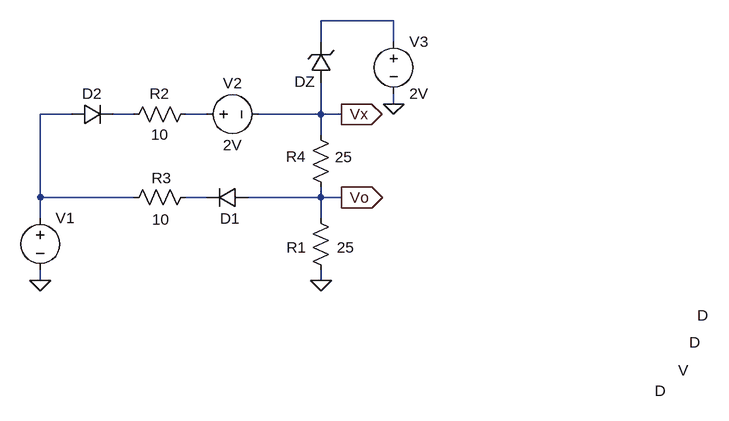
[diagram p0: schematic circuito1.asc]
circuito1.asc, the LTspice schematic file:
Version 4
SHEET 1 1016 680
WIRE 528 -160 416 -160
WIRE 416 -128 416 -160
WIRE 528 -128 528 -160
WIRE 528 -32 528 -48
WIRE 32 -16 -16 -16
WIRE 128 -16 96 -16
WIRE 240 -16 208 -16
WIRE 416 -16 416 -64
WIRE 416 -16 320 -16
WIRE 448 -16 416 -16
WIRE 416 16 416 -16
WIRE -16 112 -16 -16
WIRE 128 112 -16 112
WIRE 240 112 208 112
WIRE 416 112 416 96
WIRE 416 112 304 112
WIRE 448 112 416 112
WIRE -16 144 -16 112
WIRE 416 144 416 112
WIRE -16 240 -16 224
WIRE 416 240 416 224
FLAG 528 -32 0
FLAG 416 240 0
FLAG -16 240 0
FLAG 448 112 Vo
IOPIN 448 112 Out
FLAG 448 -16 Vx
IOPIN 448 -16 Out
SYMBOL voltage -16 128 R0
WINDOW 3 982 250 Left 2
SYMATTR InstName V1
SYMBOL diode 304 96 R90
WINDOW 0 64 28 VBottom 2
WINDOW 3 224 -688 VTop 2
SYMATTR InstName D1
SYMBOL diode 32 0 R270
WINDOW 0 32 32 VTop 2
WINDOW 3 -394 907 VBottom 2
SYMATTR InstName D2
SYMBOL res 224 96 R90
WINDOW 0 66 54 VBottom 2
WINDOW 3 -29 53 VTop 2
SYMATTR InstName 10
SYMATTR Value R3
SYMBOL res 224 -32 R90
WINDOW 0 0 56 VBottom 2
WINDOW 3 32 56 VTop 2
SYMATTR InstName R2
SYMATTR Value 10
SYMBOL voltage 224 -16 R270
WINDOW 0 32 56 VTop 2
WINDOW 3 -32 56 VBottom 2
WINDOW 123 0 0 Left 0
WINDOW 39 0 0 Left 0
SYMATTR InstName V2
SYMATTR Value 2V
SYMBOL voltage 528 -144 R0
SYMATTR InstName V3
SYMATTR Value 2V
SYMBOL zener 432 -64 R180
WINDOW 0 24 2 Left 2
WINDOW 3 -581 -358 Left 2
SYMATTR InstName DZ
SYMBOL res 432 112 R180
WINDOW 0 39 63 Left 2
WINDOW 3 -33 62 Left 2
SYMATTR InstName R4
SYMATTR Value 25
SYMBOL res 432 240 R180
WINDOW 0 38 51 Left 2
WINDOW 3 -36 51 Left 2
SYMATTR InstName R1
SYMATTR Value 25

The netlist it stands for:
* circuito1.asc
V1 N002 0 V
D1 Vo N005 D
D2 N002 N003 D
R§10 N005 N002 R3
R2 N004 N003 10
V2 N004 Vx 2V
V3 N001 0 2V
DZ Vx N001 D
R4 Vo Vx 25
R1 0 Vo 25
.model D D
.lib standard.dio
.backanno
.end